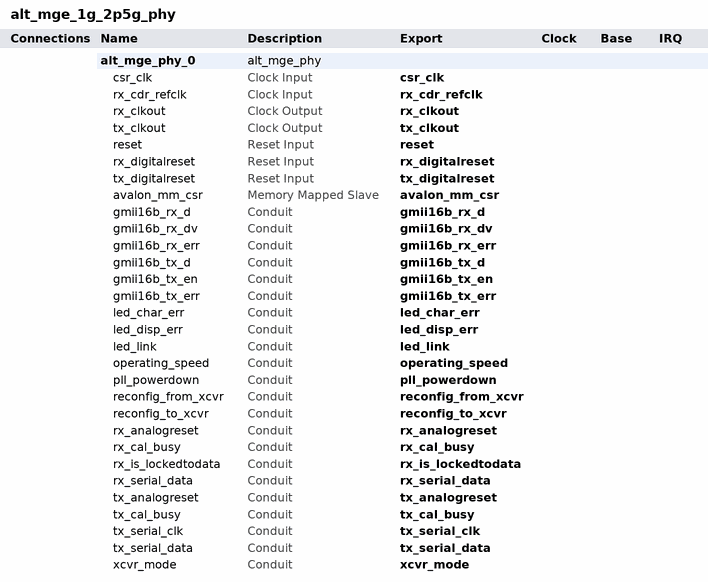
[diagram p0: system contents]
# Platform Designer (Qsys) system alt_mge_1g_2p5g_phy, Arria V Unknown
# Parameters at their usual value, and those the tool derives, are not listed.
package require qsys
create_system alt_mge_1g_2p5g_phy
set_project_property DEVICE_FAMILY {Arria V}
set_project_property DEVICE Unknown

add_instance alt_mge_phy_0 alt_mge_phy 14.1
set_instance_property alt_mge_phy_0 AUTO_EXPORT true
set_instance_parameter_value alt_mge_phy_0 DEFAULT_MODE 1
set_instance_parameter_value alt_mge_phy_0 PHY_IDENTIFIER 305419896
set_instance_parameter_value alt_mge_phy_0 SHOW_HIDDEN_OPTIONS 0
set_instance_parameter_value alt_mge_phy_0 SPEED_VARIANT 1
set_instance_parameter_value alt_mge_phy_0 TX_PLL_CLOCK_NETWORK_1G xN
set_instance_parameter_value alt_mge_phy_0 TX_PLL_CLOCK_NETWORK_2P5G xN
set_instance_parameter_value alt_mge_phy_0 TX_PMA_CLK_DIV_1G 1
set_instance_parameter_value alt_mge_phy_0 TX_PMA_CLK_DIV_2P5G 1

# exported interfaces
add_interface avalon_mm_csr avalon slave
set_interface_property avalon_mm_csr EXPORT_OF alt_mge_phy_0.avalon_mm_csr
add_interface csr_clk clock sink
set_interface_property csr_clk EXPORT_OF alt_mge_phy_0.csr_clk
add_interface gmii16b_rx_d conduit end
set_interface_property gmii16b_rx_d EXPORT_OF alt_mge_phy_0.gmii16b_rx_d
add_interface gmii16b_rx_dv conduit end
set_interface_property gmii16b_rx_dv EXPORT_OF alt_mge_phy_0.gmii16b_rx_dv
add_interface gmii16b_rx_err conduit end
set_interface_property gmii16b_rx_err EXPORT_OF alt_mge_phy_0.gmii16b_rx_err
add_interface gmii16b_tx_d conduit end
set_interface_property gmii16b_tx_d EXPORT_OF alt_mge_phy_0.gmii16b_tx_d
add_interface gmii16b_tx_en conduit end
set_interface_property gmii16b_tx_en EXPORT_OF alt_mge_phy_0.gmii16b_tx_en
add_interface gmii16b_tx_err conduit end
set_interface_property gmii16b_tx_err EXPORT_OF alt_mge_phy_0.gmii16b_tx_err
add_interface led_char_err conduit end
set_interface_property led_char_err EXPORT_OF alt_mge_phy_0.led_char_err
add_interface led_disp_err conduit end
set_interface_property led_disp_err EXPORT_OF alt_mge_phy_0.led_disp_err
add_interface led_link conduit end
set_interface_property led_link EXPORT_OF alt_mge_phy_0.led_link
add_interface operating_speed conduit end
set_interface_property operating_speed EXPORT_OF alt_mge_phy_0.operating_speed
add_interface pll_powerdown conduit end
set_interface_property pll_powerdown EXPORT_OF alt_mge_phy_0.pll_powerdown
add_interface reconfig_from_xcvr conduit end
set_interface_property reconfig_from_xcvr EXPORT_OF alt_mge_phy_0.reconfig_from_xcvr
add_interface reconfig_to_xcvr conduit end
set_interface_property reconfig_to_xcvr EXPORT_OF alt_mge_phy_0.reconfig_to_xcvr
add_interface reset reset sink
set_interface_property reset EXPORT_OF alt_mge_phy_0.reset
add_interface rx_analogreset conduit end
set_interface_property rx_analogreset EXPORT_OF alt_mge_phy_0.rx_analogreset
add_interface rx_cal_busy conduit end
set_interface_property rx_cal_busy EXPORT_OF alt_mge_phy_0.rx_cal_busy
add_interface rx_cdr_refclk clock sink
set_interface_property rx_cdr_refclk EXPORT_OF alt_mge_phy_0.rx_cdr_refclk
add_interface rx_clkout clock source
set_interface_property rx_clkout EXPORT_OF alt_mge_phy_0.rx_clkout
add_interface rx_digitalreset reset sink
set_interface_property rx_digitalreset EXPORT_OF alt_mge_phy_0.rx_digitalreset
add_interface rx_is_lockedtodata conduit end
set_interface_property rx_is_lockedtodata EXPORT_OF alt_mge_phy_0.rx_is_lockedtodata
add_interface rx_serial_data conduit end
set_interface_property rx_serial_data EXPORT_OF alt_mge_phy_0.rx_serial_data
add_interface tx_analogreset conduit end
set_interface_property tx_analogreset EXPORT_OF alt_mge_phy_0.tx_analogreset
add_interface tx_cal_busy conduit end
set_interface_property tx_cal_busy EXPORT_OF alt_mge_phy_0.tx_cal_busy
add_interface tx_clkout clock source
set_interface_property tx_clkout EXPORT_OF alt_mge_phy_0.tx_clkout
add_interface tx_digitalreset reset sink
set_interface_property tx_digitalreset EXPORT_OF alt_mge_phy_0.tx_digitalreset
add_interface tx_serial_clk conduit end
set_interface_property tx_serial_clk EXPORT_OF alt_mge_phy_0.tx_serial_clk
add_interface tx_serial_data conduit end
set_interface_property tx_serial_data EXPORT_OF alt_mge_phy_0.tx_serial_data
add_interface xcvr_mode conduit end
set_interface_property xcvr_mode EXPORT_OF alt_mge_phy_0.xcvr_mode

set_interconnect_requirement {$system} qsys_mm.clockCrossingAdapter HANDSHAKE
set_interconnect_requirement {$system} qsys_mm.insertDefaultSlave FALSE
set_interconnect_requirement {$system} qsys_mm.maxAdditionalLatency 1

save_system alt_mge_1g_2p5g_phy.qsys
